# EAGLE schematic dplus (EAGLE 9.2.2)
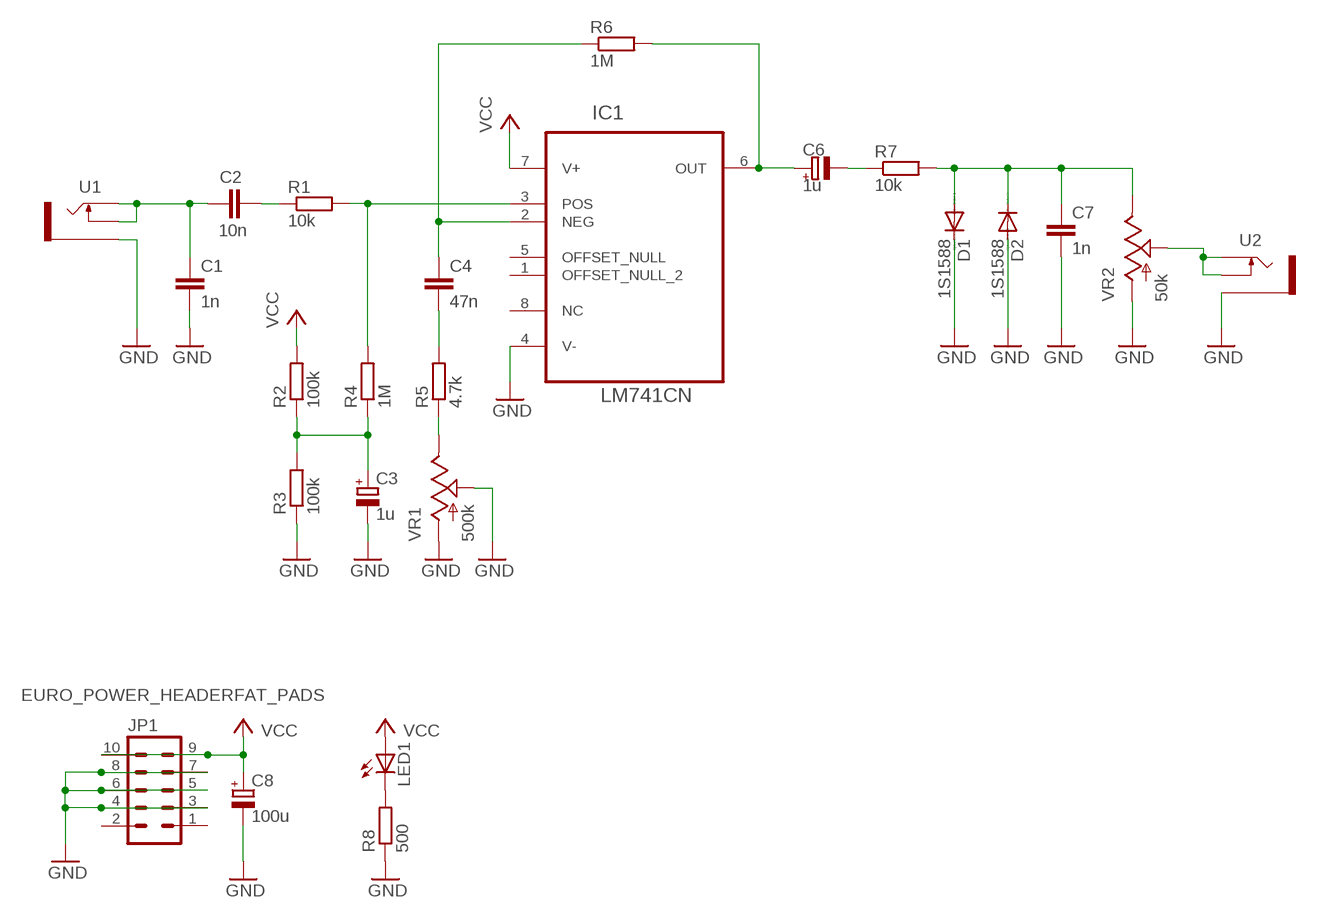
[diagram p0: schematic, sheet 1]

## Parts
C1  1n  C-EU050-025X075  [C050-025X075]
C2  10n  C-EU050-035X075  [C050-035X075]
C3  1u  CPOL-EUE2.5-5  [E2,5-5]
C4  47n  C-EU050-045X075  [C050-045X075]
C6  1u  CPOL-EUE2.5-5  [E2,5-5]
C7  1n  C-EU050-025X075  [C050-025X075]
C8  100u  CPOL-EUE2-4  [E2-4]
D1  1S1588  DIODE-D-5  [D-5]
D2  1S1588  DIODE-D-5  [D-5]
IC1  LM741CN  [DIP254P762X508-8]
JP1  EURO_POWER_HEADERFAT_PADS  [EURO_PWR_HEADER_FAT]
LED1  LED3MM  [LED3MM]
R1  10k  R-EU_R1206W  [R1206W]
R2  100k  R-EU_R1206W  [R1206W]
R3  100k  R-EU_R1206W  [R1206W]
R4  1M  R-EU_R1206W  [R1206W]
R5  4.7k  R-EU_R1206W  [R1206W]
R6  1M  R-EU_R1206W  [R1206W]
R7  10k  R-EU_R1206W  [R1206W]
R8  500  R-EU_R1206W  [R1206W]
U1  THONKICONNOLD  [THONKICONN]
U2  THONKICONNOLD  [THONKICONN]
VR1  500k  9MM_SNAP-IN_POT_  [9MM_SNAP-IN_POT]
VR2  50k  9MM_SNAP-IN_POT_  [9MM_SNAP-IN_POT]

## Nets
GND: C1.2 C3.- C7.2 C8.- D1.C D2.A IC1.4(V-) JP1.3 JP1.4 JP1.5 JP1.6 JP1.7 JP1.8 R3.1 R8.1 U1.P$1_SLEEVE(SLEEVE) U2.P$1_SLEEVE(SLEEVE) VR1.1(A) VR1.2(S) VR2.1(A)
N$1: C2.2 R1.1
N$2: C1.1 C2.1 U1.P$2_SWITCH(SWITCH) U1.P$3_TIP(TIP)
N$3: C3.+ R2.1 R3.2 R4.1
N$4: IC1.3(POS) R1.2 R4.2
N$5: C4.1 IC1.2(NEG) R6.1
N$6: C6.+ IC1.6(OUT) R6.2
N$7: C4.2 R5.2
N$8: C7.1 D1.A D2.C R7.2 VR2.3(E)
N$9: C6.- R7.1
N$10: R5.1 VR1.3(E)
N$11: U2.P$2_SWITCH(SWITCH) U2.P$3_TIP(TIP) VR2.2(S)
N$12: LED1.K(C) R8.2
VCC: C8.+ IC1.7(V+) JP1.9 JP1.10 LED1.A R2.2
Unconnected: IC1.1(OFFSET_NULL_2) IC1.5(OFFSET_NULL) IC1.8(NC) JP1.1 JP1.2

## Library data of the parts
C1 C2 C4 C7 = rcl:C-EU: CAPACITOR, European symbol; SPICEPREFIX: C
C3 C6 C8 = rcl:CPOL-EU: POLARIZED CAPACITOR, European symbol; SPICEPREFIX: C
D1 D2 = diode:DIODE-: DIODE
IC1 = LM741CN:LM741CN: OP AMP; AVAILABILITY: Unavailable; MF: Texas Instruments; MP: LM741CN/NOPB; PACKAGE: DIP-8 Microsemi; PRICE: None
JP1 = MusicThingModular:EURO_POWER_HEADER: Power Header 10 pin power header for Eurorack Power Supplies Variants with fatter pads for easier soldering, and the LOCK variant which has 5mil offset pins to hold the component in place before soldering
LED1 = led:LED: LED OSRAM: - CHIPLED LG R971, LG N971, LY N971, LG Q971, LY Q971, LO R971, LY R971 LH N974, LH R974 LS Q976, LO Q976, LY Q976 LO Q996 - Hyper CHIPLED LW Q18S LB Q993, LB Q99A, LB R99A - SideLED LS A670, LO A670, LY A670, LG A670, LP A670 LB A673, LV A673, LT A673, LW A673 LH A674 LY A675 LS A676, LA A676, LO A676, LY A676, LW A676 LS A679, LY A679, LG A679 - Hyper Micro SIDELED® LS Y876, LA Y876, LO Y876, LY Y876 LT Y87S - SmartLED LW L88C, LW L88S LB L89C, LB L89S, LG L890 LS L89K, LO L89K, LY L89K LS L896, LA L896, LO L896, LY L896 - TOPLED LS T670, LO T670, LY T670, LG T670, LP T670 LSG T670, LSP T670, LSY T670, LOP T670, LYG T670 LG T671, LOG T671, LSG T671 LB T673, LV T673, LT T673, LW T673 LH T674 LS T676, LA T676, LO T676, LY T676, LB T676, LH T676, LSB T676, LW T676 LB T67C, LV T67C, LT T67C, LS T67K, LO T67K, LY T67K, LW E67C LS E67B, LA E67B, LO E67B, LY E67B, LB E67C, LV E67C, LT E67C LW T67C LS T679, LY T679, LG T679 LS T770, LO T770, LY T770, LG T770, LP T770 LB T773, LV T773, LT T773, LW T773 LH T774 LS E675, LA E675, LY E675, LS T675 LS T776, LA T776, LO T776, LY T776, LB T776 LHGB T686 LT T68C, LB T68C - Hyper Mini TOPLED® LB M676 - Mini TOPLED Santana® LG M470 LS M47K, LO M47K, LY M47K Source: http://www.osram.convergy.de LUXEON: - LUMILED® LXK2-PW12-R00, LXK2-PW12-S00, LXK2-PW14-U00, LXK2-PW14-V00 LXK2-PM12-R00, LXK2-PM12-S00, LXK2-PM14-U00 LXK2-PE12-Q00, LXK2-PE12-R00, LXK2-PE12-S00, LXK2-PE14-T00, LXK2-PE14-U00 LXK2-PB12-K00, LXK2-PB12-L00, LXK2-PB12-M00, LXK2-PB14-N00, LXK2-PB14-P00, LXK2-PB14-Q00 LXK2-PR12-L00, LXK2-PR12-M00, LXK2-PR14-Q00, LXK2-PR14-R00 LXK2-PD12-Q00, LXK2-PD12-R00, LXK2-PD12-S00 LXK2-PH12-R00, LXK2-PH12-S00 LXK2-PL12-P00, LXK2-PL12-Q00, LXK2-PL12-R00 Source: www.luxeon.com KINGBRIGHT: KA-3528ASYC Source: www.kingbright.com
R1-R8 = rcl:R-EU_: RESISTOR, European symbol; SPICEPREFIX: R
U1 U2 = MusicThingModular:THONKICONN: 3.5mm socket for Eurorack modular synths
VR1 VR2 = MusicThingModular:9MM_SNAP-IN_POT: 9mm vertical snap-in pot, Alpha / Panasonic style